# EAGLE design HAP-ZCD-3.0-1 (EAGLE 4.16)
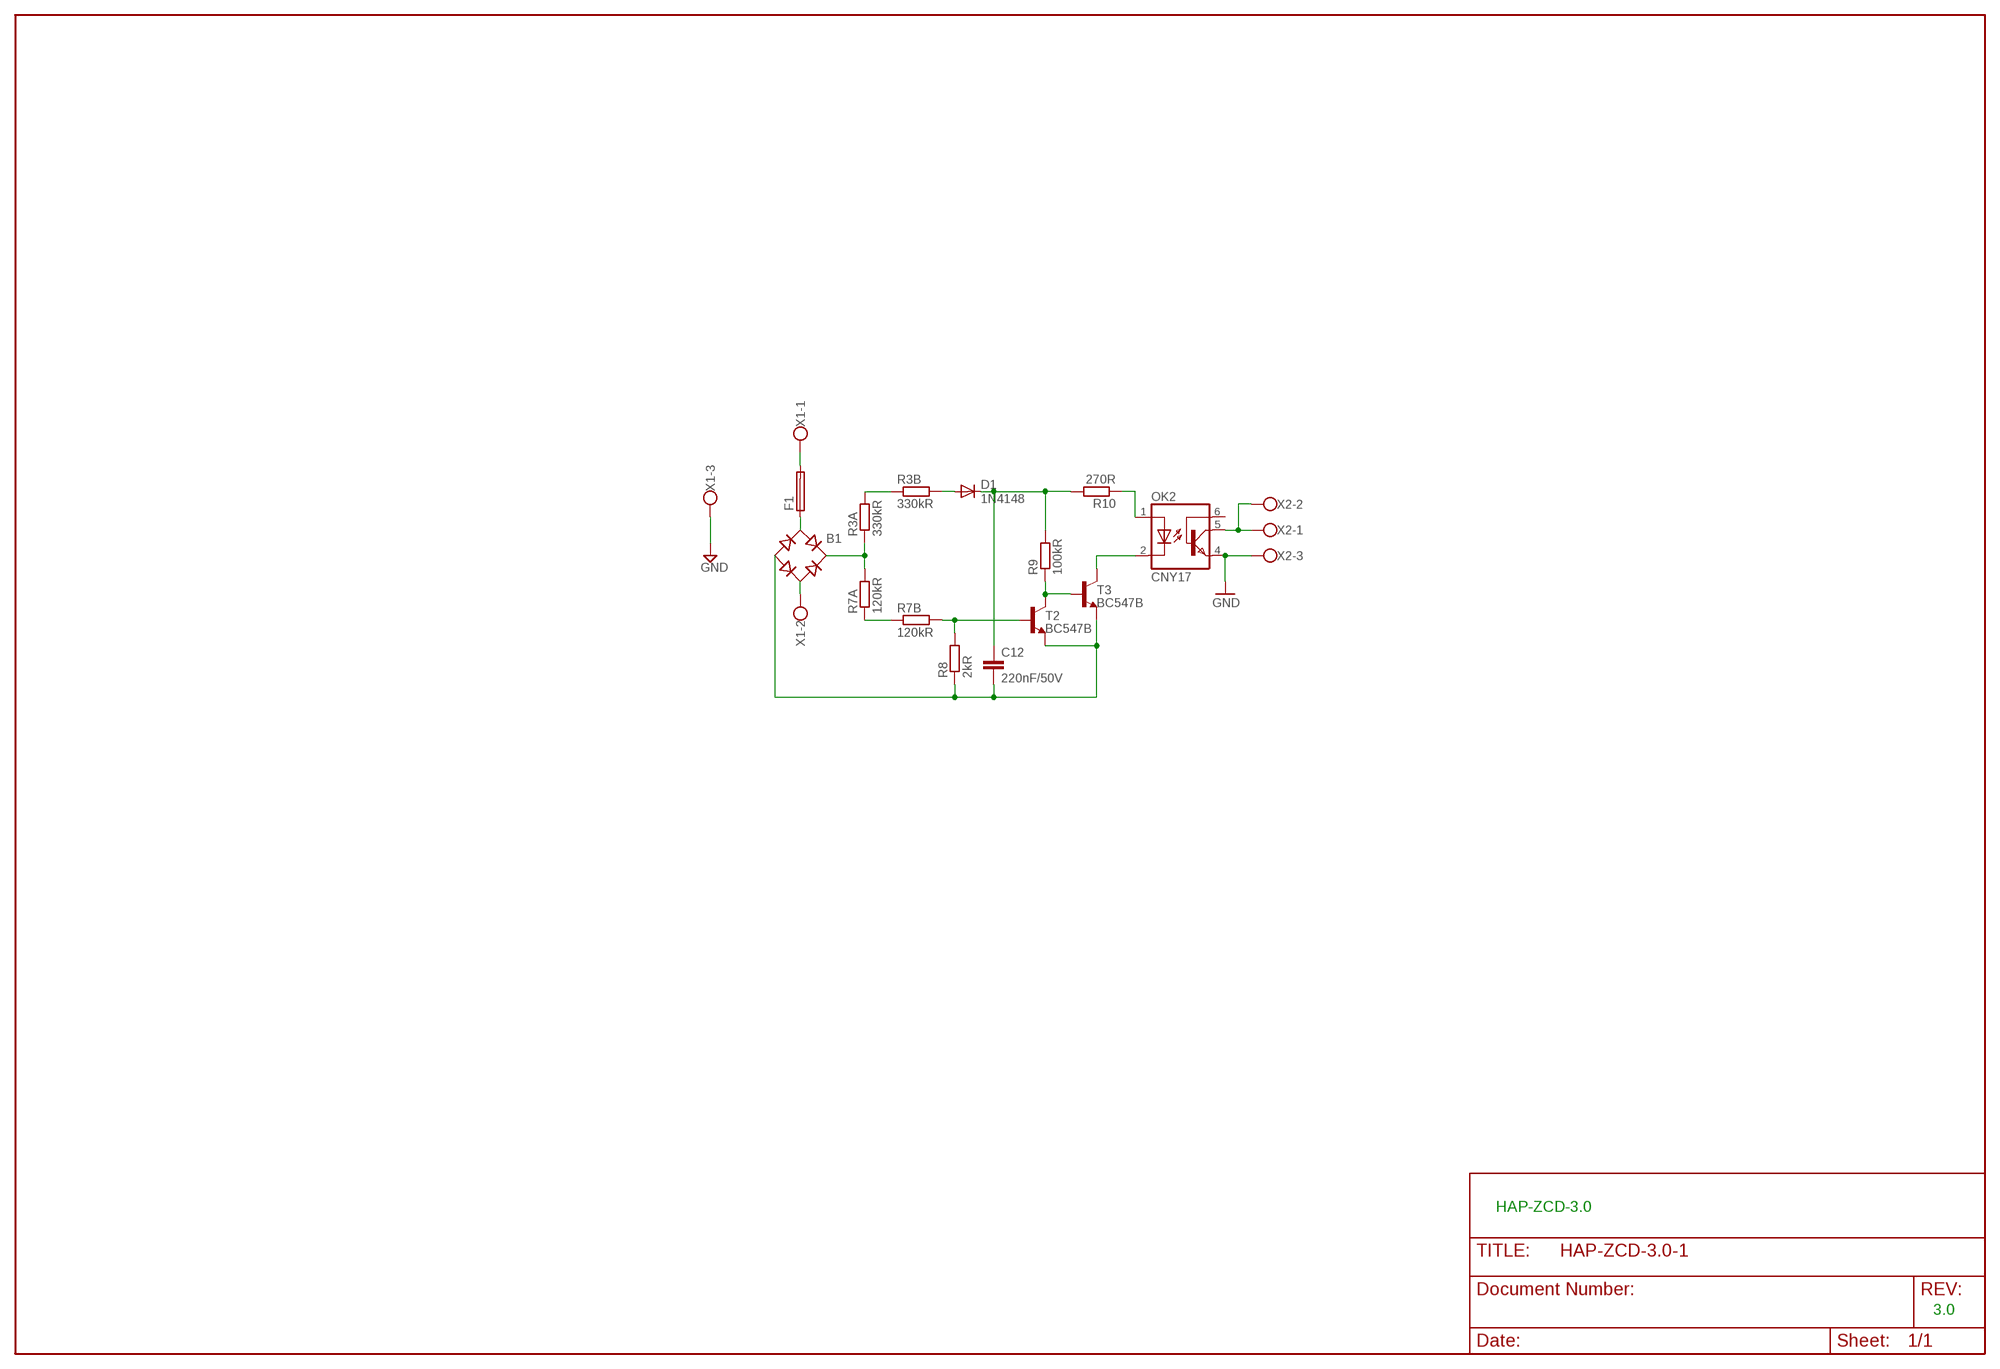
[diagram p0: schematic, sheet 1]

## Parts
B1  B-DIL  [B-DIL]
C12  220nF/50V  C-EU025-025X050  [C025-025X050]
D1  1N4148  [DO35-10]
F1  19560  [19560]
OK2  CNY17  [DIL06]
R3A  330kR  R-EU_0207/2V  [0207/2V]
R3B  330kR  R-EU_0207/2V  [0207/2V]
R7A  120kR  R-EU_0207/2V  [0207/2V]
R7B  120kR  R-EU_0207/2V  [0207/2V]
R8  2kR  R-EU_0207/2V  [0207/2V]
R9  100kR  R-EU_0207/2V  [0207/2V]
R10  270R  R-EU_0207/2V  [0207/2V]
T2  BC547B  [TO92]
T3  BC547B  [TO92]
X1  W237-03P  [W237-133]
X2  W237-03P  [W237-133]

## Nets
GND: OK2.4(EMI) X2.3
GND230: X1.3 ; supply symbol labelled GND
N$1: R9.1 T2.3(C) T3.2(B)
N$2 [mains]: B1.AC2 X1.2
N$3 [mains]: B1.AC1 F1.1
N$4: OK2.1(A) R10.1
N$5: OK2.5(COL) X2.1 X2.2
N$6 [mains]: F1.2 X1.1
N$25: R3A.2 R3B.1
N$26: R7B.2 R8.2 T2.2(B)
N$34: B1.+ R3A.1 R7A.2
N$37: R7A.1 R7B.1
N$38: B1.- C12.2 R8.1 T2.1(E) T3.1(E)
N$40: D1.A R3B.2
N$57: C12.1 D1.C R9.2 R10.2
N$62: OK2.2(C) T3.3(C)
Unconnected: OK2.6(BAS)

## Notes on the sheet
- HAP-ZCD-3.0
- 3.0

## Library data of the parts
B1 = rectifier:B-DIL: RECTIFIER
C12 = rcl:C-EU: CAPACITOR, European symbol
D1 = diode:1N4148: DIODE high speed (Philips)
F1 = fuse:19560: FUSE HOLDER TR5, Wickmann
OK2 = optocoupler:CNY17: SIEMENS OPTO COUPLER
R3A R3B R7A R7B R8-R10 = rcl:R-EU_: RESISTOR, European symbol
T2 T3 = transistor-npn:BC547*: NPN Transistor
X1 X2 = con-wago-508:W237-03P: WAGO SREW CLAMP

## Net classes
0 default: width 0.406 mm, drill 0.406 mm
1 mains: width 0.61 mm, drill 0.61 mm

## Board
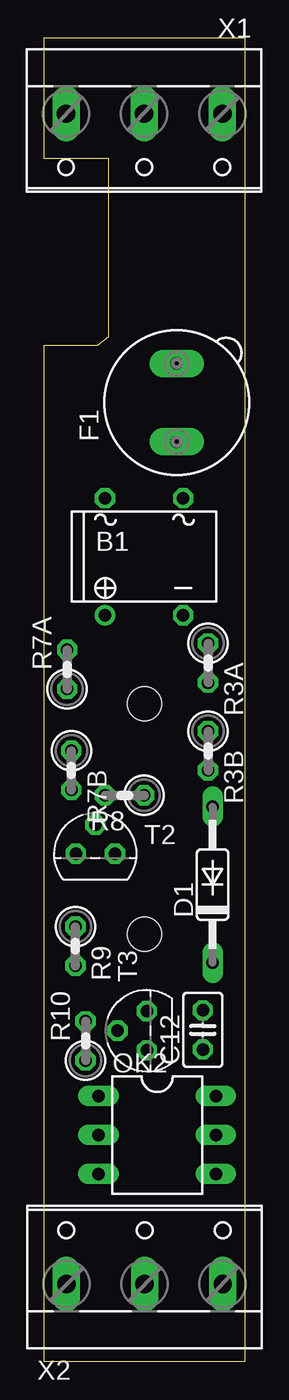
[diagram p1: board, top side]
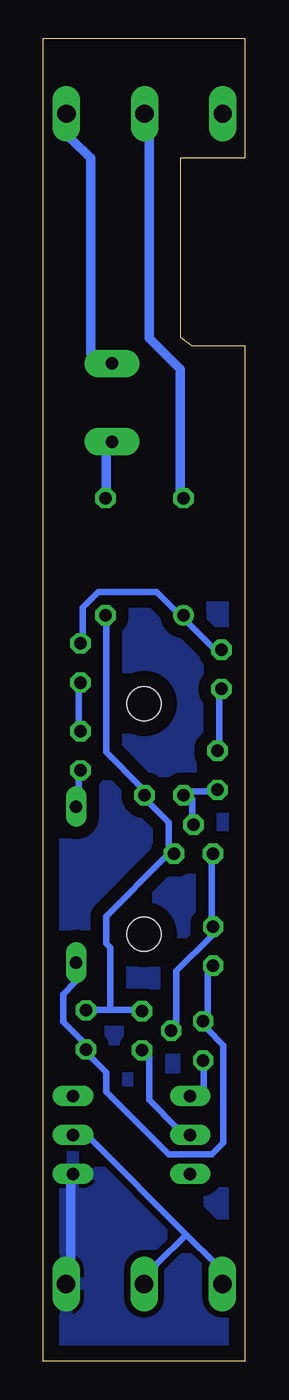
[diagram p2: board, bottom side, seen from below]

Size 13.1 x 86 mm. Coordinates in mm from the lower left corner, seen from the top.
Outline: 0,66.04 0,0 13.1,0 13.1,86 0,86 0,78.2 4.19,78.2 4.19,66.56 3.46,66.04 0,66.04
Copper layers (1*16): Top 0.035mm / dielectric 1.5mm / Bottom 0.035mm
Design rules "default": minimum track width 10mil, minimum drill 24mil, track to track 8mil, track to pad 8mil, pad to pad 8mil, via to via 8mil, smd to smd 8mil, copper to edge 40mil, drill to drill 8mil, minimum pad ring 10mil, minimum via ring 8mil, stop-mask expansion 4mil, vias tented up to drill 0mil, thermal gap 10mil
Holes 2.2 mm at 6.55,42.75 6.55,27.75

### Footprints (pad centres in the part's own frame; a part is rotated, then mirrored left to right if it is on the bottom)
B-DIL = drill 0.813 round: + -2.54,-3.81 | drill 0.813 octagon: - 2.54,-3.81; AC1 2.54,3.81; AC2 -2.54,3.81
C025-025X050 = drill 0.813 octagon: 1 -1.27,0; 2 1.27,0
DO35-10 = drill 0.813 long: A 5.08,0; C -5.08,0
19560 = drill 0.813 pad 1.778 long: 1 -2.54,0; 2 2.54,0
DIL06 = drill 0.813 long: 1 -2.54,-3.81; 2 0,-3.81; 3 2.54,-3.81; 4 2.54,3.81; 5 0,3.81; 6 -2.54,3.81
0207/2V = drill 0.813 octagon: 1 -1.27,0; 2 1.27,0
TO92 = drill 0.813 octagon: 1 1.27,0; 2 0,1.905; 3 -1.27,0
W237-133 = drill 1.194 long: 1 -5.08,-0.635; 2 0,-0.635; 3 5.08,-0.635

### Placement (x,y rotation side)
B1  6.52,52.3 0 top
C12  10.33,21.54 90 top
D1  10.96,30.98 90 top
F1  8.64,62.33 90 top
OK2  7.36,14.7 270 top
R3A  10.68,45.39 270 top
R3B  10.68,39.67 270 top
R7A  1.51,44.97 90 top
R7B  1.79,38.41 270 top
R8  5.25,36.79 180 top
R9  2.05,26.98 270 top
R10  2.71,20.82 90 top
T2  3.34,32.98 0 top
T3  6.69,21.48 90 top
X1  6.52,80.47 180 top
X2  6.54,5.64 0 top

### Tracks (layer width: path | path; a pad name or v marks a point on that pad's centre or on a via)
GND
  Bottom 0.61: OK2.4 11.3,11.65 11.3,6.57 X2.3
  pour Bottom (isolate 0.406): 0.38,7.08 2.92,7.08 10.54,14.7 13.08,14.7 13.08,-0.54 0.38,-0.54
GND230
  pour Bottom (isolate 0.813): 0.38,48.99 13.08,48.99 13.08,19.78 11.81,18.51 10.54,18.51 1.65,9.62 0.38,9.62 -0.25,10.26
N$1
  Bottom 0.406: T3.2 4.44,22.07 4.44,25.37 2.16,27.65 R9.1 2.16,28.67 2.16,32.48 T2.3
N$2
  Bottom 0.61: B1.AC2 4.19,56.61 4.19,64.48 6.22,66.52 6.22,79.47 X1.2
N$3
  Bottom 0.61: B1.AC1 9.02,56.61 9.02,59.15 F1.1
N$4
  Bottom 0.406: R10.1 2.67,19.02 2.67,17.75 OK2.1
N$5
  Bottom 0.406: 3.81,8.22 1.9,6.32 X2.1 | 3.81,8.22 10.03,14.45 OK2.5 | X2.2 5.71,6.32 3.81,8.22
N$6
  Bottom 0.61: F1.2 10.03,65.5 10.03,78.2 11.3,79.47 X1.1
N$25
  Bottom 0.406: R3B.1 10.79,41.37 10.79,43.66 R3A.2
N$26
  Bottom 0.406: T2.2 3.43,35.53 3.43,36.54 R8.2 3.43,37.05 2.41,37.05 R7B.2
N$34
  Bottom 0.406: R7A.2 2.16,46.45 3.68,47.97 B1.+ 4.44,48.74 5.71,50.01 9.52,50.01 10.54,48.99 10.54,47.21 R3A.1
N$37
  Bottom 0.406: R7B.1 1.65,40.1 1.65,43.15 R7A.1
N$38
  Bottom 0.406: 8.76,22.83 9.78,22.83 C12.2 | 8.76,22.83 7.24,22.83 T3.1 | B1.- 9.02,47.97 9.02,39.59 6.73,37.31 R8.1 6.22,36.29 4.95,35.02 4.95,33.5 T2.1 5.21,32.73 9.02,28.92 9.02,27.15 8.76,26.89 8.76,22.83
N$40
  Bottom 0.406: D1.A 10.79,37.31 10.79,37.81 R3B.2
N$57
  Bottom 0.406: R9.2 2.41,25.37 2.41,22.57 R10.2 2.41,21.56 1.4,20.54 1.4,14.19 2.16,13.43 4.95,13.43 9.02,17.49 9.02,18.76 10.03,19.78 C12.1 10.54,20.8 11.81,22.07 11.81,23.84 11.05,24.61 D1.C
N$62
  Bottom 0.406: OK2.2 4.44,15.21 6.22,16.99 6.22,19.78 T3.3